# EAGLE design tuggerTrackerV1 (EAGLE 8.5.0)
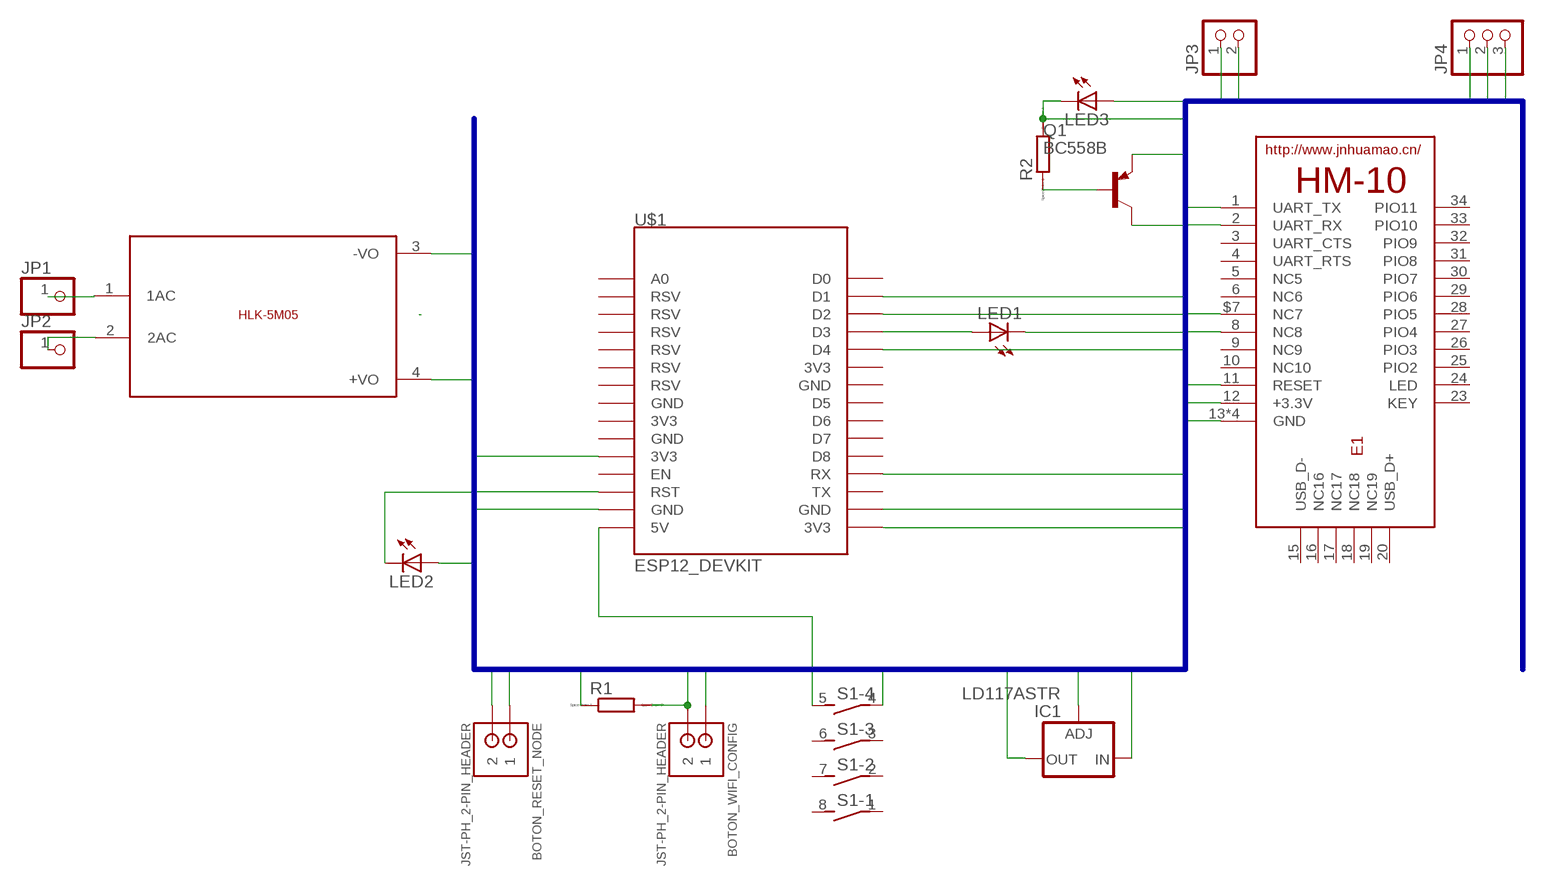
[diagram p0: schematic, sheet 1]

## Parts
BOTON_RESET_NODE  JST-PH_2-PIN_HEADER  [JST_B2B-PH_HEADER]
BOTON_WIFI_CONFIG  JST-PH_2-PIN_HEADER  [JST_B2B-PH_HEADER]
E1  HM-10-BOARD  [26.9X13X2.2_BOARD]
IC1  LD117ASTR  [SOT223]
JP1  PINHD-1X1  [1X01]
JP2  PINHD-1X1  [1X01]
JP3  PINHD-1X2  [1X02]
JP4  PINHD-1X3  [1X03]
LED1  LEDCHIPLED_1206  [CHIPLED_1206]
LED2  LEDCHIPLED_1206  [CHIPLED_1206]
LED3  LEDCHIPLED_1206  [CHIPLED_1206]
Q1  BC558B  [TO92-EBC]
R1  R0207/10  [0207/10]
R2  R0207/10  [0207/10]
S1  DIP04S  [DIP04S]
U$1  ESP12_DEVKIT  [ESP12_DEVKIT]
U$2  5VDC/5W  HLK-5M05  [HLK-5M05]

## Nets
BTPG1: E1.$7(NC7) JP4.1
BTPG2: E1.8(NC8) JP4.2
BTRST: E1.11(RESET) JP4.3
BTVCC: E1.12(+3.3V) Q1.C
D1: LED3.C R2.2 U$1.D1
D2: BOTON_WIFI_CONFIG.P2 R1.2 U$1.D2
GND: BOTON_RESET_NODE.P2 E1.13(GND) E1.14(GND) E1.21(GND) E1.22(GND) IC1.1(ADJ) JP3.1 LED1.C LED2.C R1.1 U$1.GND@1(GND) U$1.GND@3(GND) U$2.3(-VO)
N$1: S1.5 U$1.5V
N$2: Q1.B R2.1
N$3: JP1.1 U$2.1(1AC)
N$5: JP2.1 U$2.2(2AC)
N$6: LED1.A U$1.D3
NODRST: BOTON_RESET_NODE.P1 U$1.RST
NRXBTX: E1.1(UART_TX) U$1.RX
NTXBRX: E1.2(UART_RX) U$1.D4
V3NODE: BOTON_WIFI_CONFIG.P1 LED2.A LED3.A U$1.3V3@0(3V3) U$1.3V3@2(3V3)
V3REG: IC1.4(OUT) Q1.E
VIN: IC1.3(IN) JP3.2 S1.4 U$2.4(+VO)
Unconnected: E1.3(UART_CTS) E1.4(UART_RTS) E1.5(NC5) E1.6(NC6) E1.9(NC9) E1.10(NC10) E1.15(USB_D-) E1.16(NC16) E1.17(NC17) E1.18(NC18) E1.19(NC19) E1.20(USB_D+) E1.23(KEY) E1.24(LED) E1.25(PIO2) E1.26(PIO3) E1.27(PIO4) E1.28(PIO5) E1.29(PIO6) E1.30(PIO7) E1.31(PIO8) E1.32(PIO9) E1.33(PIO10) E1.34(PIO11) S1.1 S1.2 S1.3 S1.6 S1.7 S1.8 U$1.3V3@1(3V3) U$1.3V3@3(3V3) U$1.A0 U$1.D0 U$1.D5 U$1.D6 U$1.D7 U$1.D8 U$1.EN U$1.GND@0(GND) U$1.GND@2(GND) U$1.GND@4(GND) U$1.RSV@0(RSV) U$1.RSV@1(RSV) U$1.RSV@2(RSV) U$1.RSV@3(RSV) U$1.RSV@4(RSV) U$1.RSV@5(RSV) U$1.TX

## Buses
V3NODE,V3REG,VIN,GND,GNDBT,D1,D2,BTPG1,BTPG2,BTRST,BTVCC,NRXBTX,NTXBRX,NODRST

## Library data of the parts
BOTON_RESET_NODE BOTON_WIFI_CONFIG = SRG:JST-PH_2-PIN_HEADER: 2-pin JST PH Shrouded Header, top entry P/N B2B-PH-K-S Mating connector PHR-2 Mating cable assembly: Sparkfun PRT-09914 <http://www.sparkfun.com/products/9914>
E1 = JNHuaMao:HM-10: HM Bluetooth module use TI CC2540 or CC2541, Master and slave roles in one, transmission version and remote control version and PIO state acquisition functions in one, Support the AT command modify module parameters, Convenient and flexible.
IC1 = v-reg:LD117A?*: Low drop fixed and adjustable positive voltage regulators 1 A Source: http://www.st.com/stonline/products/literature/ds/7194/ld1117axx.pdf
JP1 JP2 = pinhead:PINHD-1X1: PIN HEADER
JP3 = pinhead:PINHD-1X2: PIN HEADER
JP4 = pinhead:PINHD-1X3: PIN HEADER
LED1-LED3 = led:LED: LED OSRAM: - CHIPLED LG R971, LG N971, LY N971, LG Q971, LY Q971, LO R971, LY R971 LH N974, LH R974 LS Q976, LO Q976, LY Q976 LO Q996 - Hyper CHIPLED LW Q18S LB Q993, LB Q99A, LB R99A - SideLED LS A670, LO A670, LY A670, LG A670, LP A670 LB A673, LV A673, LT A673, LW A673 LH A674 LY A675 LS A676, LA A676, LO A676, LY A676, LW A676 LS A679, LY A679, LG A679 - Hyper Micro SIDELED® LS Y876, LA Y876, LO Y876, LY Y876 LT Y87S - SmartLED LW L88C, LW L88S LB L89C, LB L89S, LG L890 LS L89K, LO L89K, LY L89K LS L896, LA L896, LO L896, LY L896 - TOPLED LS T670, LO T670, LY T670, LG T670, LP T670 LSG T670, LSP T670, LSY T670, LOP T670, LYG T670 LG T671, LOG T671, LSG T671 LB T673, LV T673, LT T673, LW T673 LH T674 LS T676, LA T676, LO T676, LY T676, LB T676, LH T676, LSB T676, LW T676 LB T67C, LV T67C, LT T67C, LS T67K, LO T67K, LY T67K, LW E67C LS E67B, LA E67B, LO E67B, LY E67B, LB E67C, LV E67C, LT E67C LW T67C LS T679, LY T679, LG T679 LS T770, LO T770, LY T770, LG T770, LP T770 LB T773, LV T773, LT T773, LW T773 LH T774 LS E675, LA E675, LY E675, LS T675 LS T776, LA T776, LO T776, LY T776, LB T776 LHGB T686 LT T68C, LB T68C - Hyper Mini TOPLED® LB M676 - Mini TOPLED Santana® LG M470 LS M47K, LO M47K, LY M47K Source: http://www.osram.convergy.de LUXEON: - LUMILED® LXK2-PW12-R00, LXK2-PW12-S00, LXK2-PW14-U00, LXK2-PW14-V00 LXK2-PM12-R00, LXK2-PM12-S00, LXK2-PM14-U00 LXK2-PE12-Q00, LXK2-PE12-R00, LXK2-PE12-S00, LXK2-PE14-T00, LXK2-PE14-U00 LXK2-PB12-K00, LXK2-PB12-L00, LXK2-PB12-M00, LXK2-PB14-N00, LXK2-PB14-P00, LXK2-PB14-Q00 LXK2-PR12-L00, LXK2-PR12-M00, LXK2-PR14-Q00, LXK2-PR14-R00 LXK2-PD12-Q00, LXK2-PD12-R00, LXK2-PD12-S00 LXK2-PH12-R00, LXK2-PH12-S00 LXK2-PL12-P00, LXK2-PL12-Q00, LXK2-PL12-R00 Source: www.luxeon.com KINGBRIGHT: KA-3528ASYC Source: www.kingbright.com
Q1 = transistor-pnp:BC558*: PNP Transistror
R1 R2 = eagle-ltspice:R: RESISTOR, European symbol; SPICEMODEL: NONE; SPICEPREFIX: R
S1 = switch-dil:DIP04S: DIL/CODE SWITCH; OC_FARNELL: unknown; OC_NEWARK: unknown
U$1 = ESP12_DEVKIT:ESP12_DEVKIT: ESP12 DEVKIT BOARD
U$2 = HLK-5M05:HLK-5M05: HLK-5M05 is an 5Volt/5W smps developed by HI-LINK; SIZE: 23x38(mm)

## Board
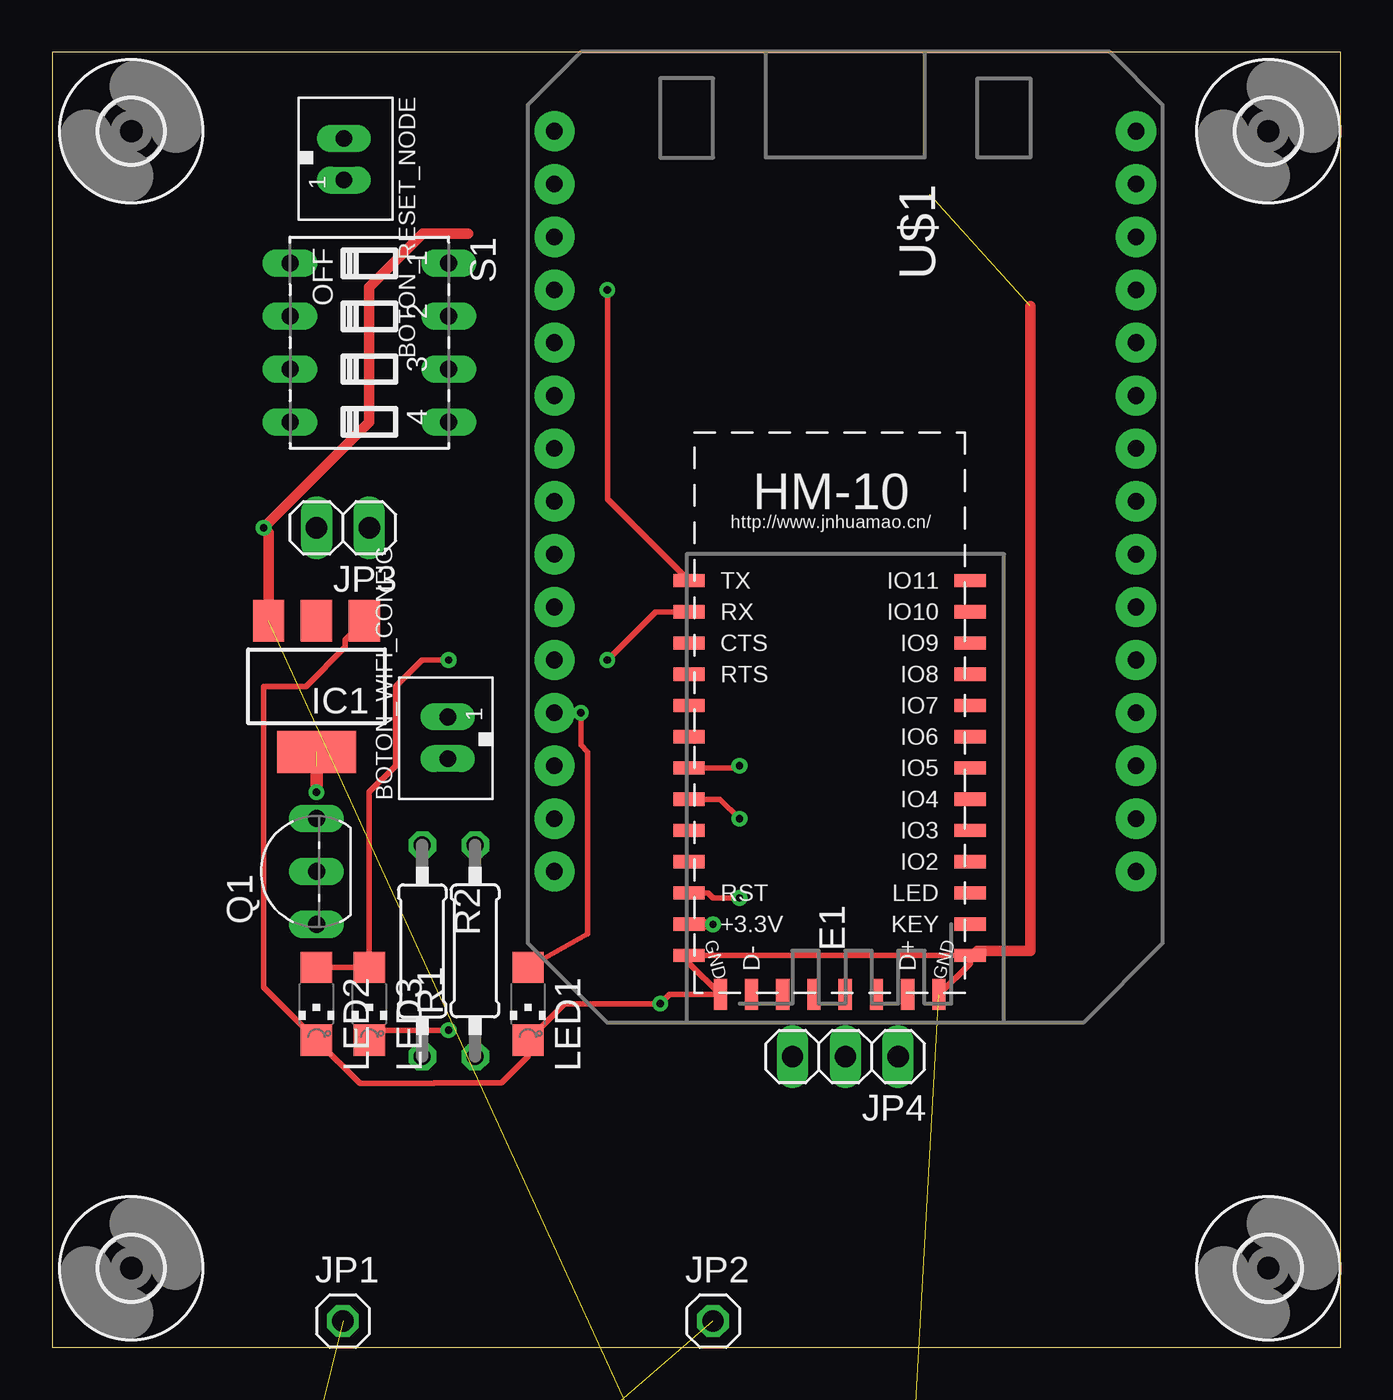
[diagram p1: board, top side]
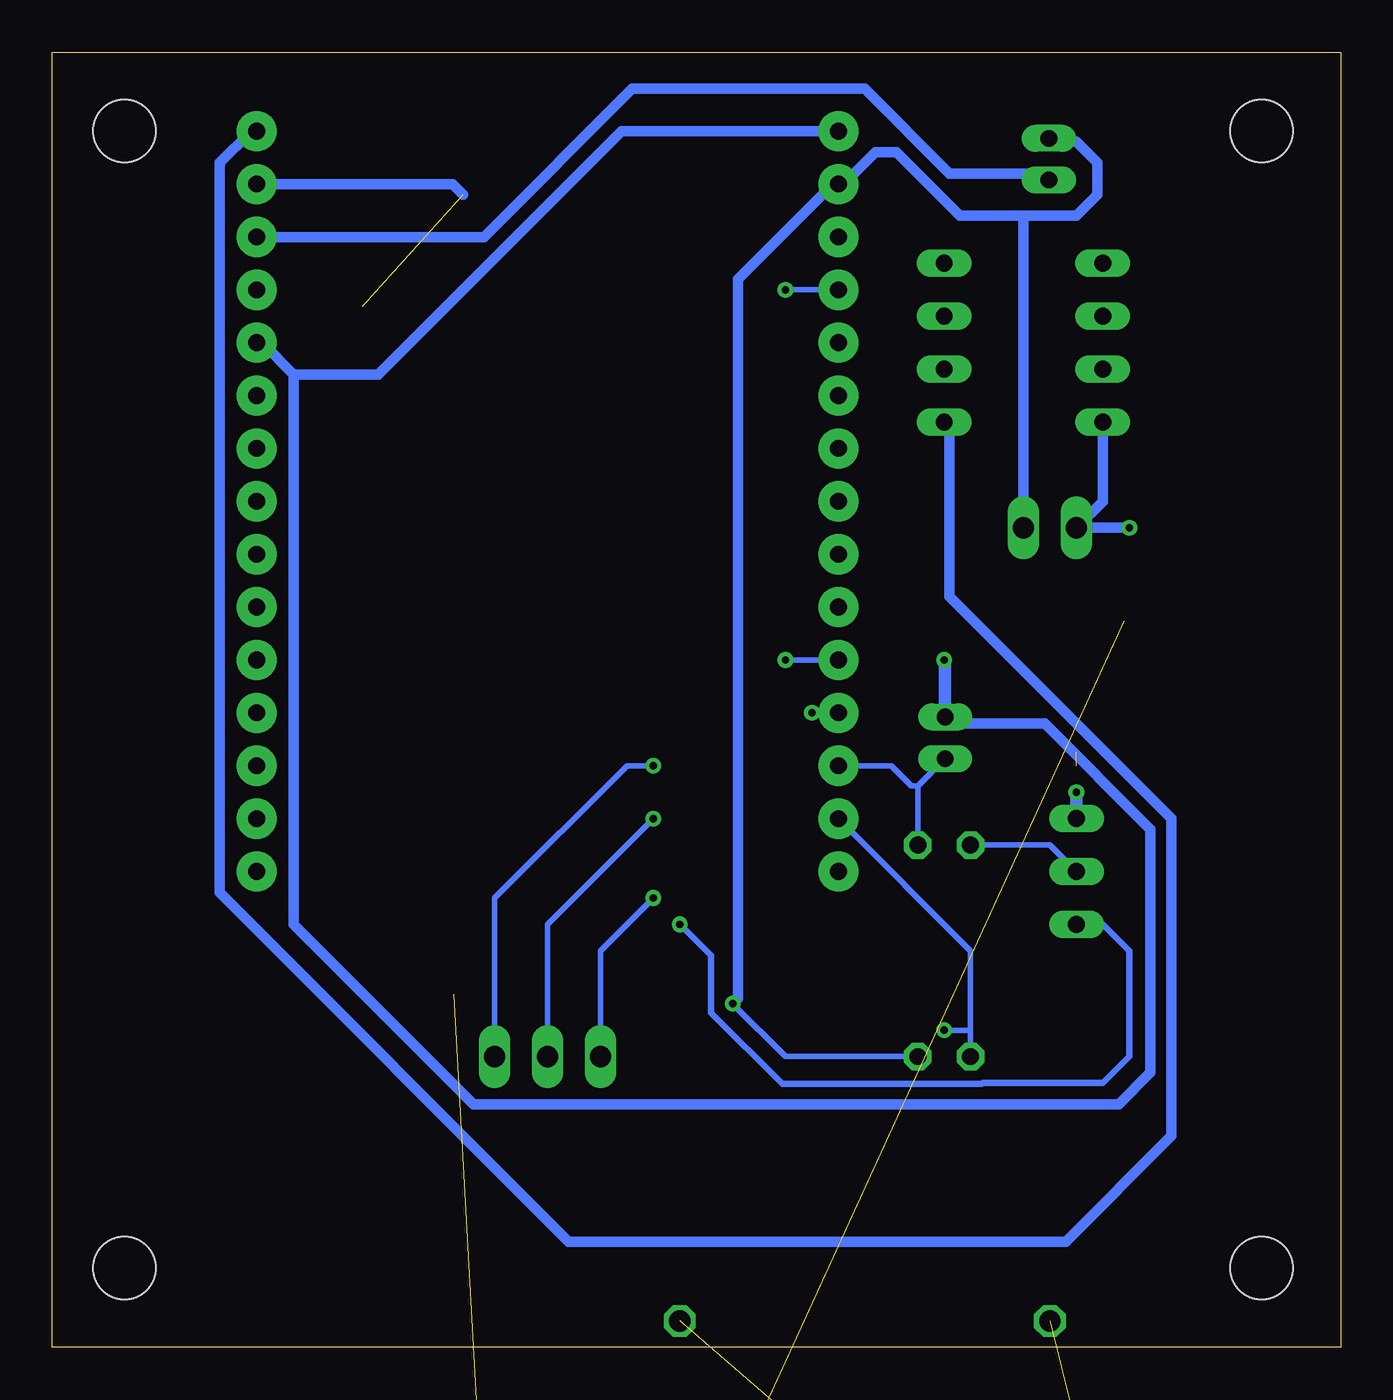
[diagram p2: board, bottom side, seen from below]

Size 61.9 x 62.22 mm. Coordinates in mm from the lower left corner, seen from the top.
Outline: 0,0 61.9,0 61.9,62.22 0,62.22 0,0
Copper layers (1*16): Top 0.035mm / dielectric 1.5mm / Bottom 0.035mm
Design rules "default *": minimum track width 20mil, minimum drill 0.35mm, track to track 20mil, track to pad 20mil, pad to pad 20mil, via to via 20mil, smd to smd 20mil, copper to edge 40mil, drill to drill 20mil, minimum pad ring 10mil, minimum via ring 8mil, stop-mask expansion 4mil, vias tented up to drill 0mil, thermal gap 10mil

### Footprints (pad centres in the part's own frame; a part is rotated, then mirrored left to right if it is on the bottom)
JST_B2B-PH_HEADER = drill 0.8 long: P1 1.075,0.048; P2 -0.925,0.048
26.9X13X2.2_BOARD = smd 1.5 x 0.635: 1 -7.5,0; 2 -7.5,-1.5; 3 -7.5,-3; 4 -7.5,-4.5; 5 -7.5,-6; 6 -7.5,-7.5; 8 -7.5,-10.5; 9 -7.5,-12; 10 -7.5,-13.5; 11 -7.5,-15; 12 -7.5,-16.5; 13 -7.5,-18; 22 6,-18; 23 6,-16.5; 24 6,-15; 25 6,-13.5; 26 6,-12; 27 6,-10.5; 28 6,-9; 29 6,-7.5; 30 6,-6; 31 6,-4.5; 32 6,-3; 33 6,-1.5; 34 6,0; $7 -7.5,-9 | smd 0.635 x 1.5: 14 -6,-19.875; 15 -4.5,-19.875; 16 -3,-19.875; 17 -1.5,-19.875; 18 0,-19.875; 19 1.5,-19.875; 20 3,-19.875; 21 4.5,-19.875
SOT223 = smd 1.5 x 2: 1 -2.3,-3.15; 2 0,-3.15; 3 2.3,-3.15 | smd 3.8 x 2: 4 0,3.15
1X01 = drill 1.016 octagon: 1 0,0
1X02 = drill 1.016 long: 1 -1.27,0; 2 1.27,0
1X03 = drill 1.016 long: 1 -2.54,0; 2 0,0; 3 2.54,0
CHIPLED_1206 = smd 1.5 x 1.5: A 0,-1.75; C 0,1.75
TO92-EBC = drill 0.813 long: B 0,-1.27; C -2.54,-1.27; E 2.54,-1.27
0207/10 = drill 0.813 octagon: 1 -5.08,0; 2 5.08,0
DIP04S = drill 0.813 long: 1 -3.81,-3.81; 2 -1.27,-3.81; 3 1.27,-3.81; 4 3.81,-3.81; 5 3.81,3.81; 6 1.27,3.81; 7 -1.27,3.81; 8 -3.81,3.81
ESP12_DEVKIT = drill 0.8 pad 1.93: 3V3@0 -13.97,-7.62; 3V3@1 13.97,5.08; 3V3@2 13.97,-17.78; 3V3@3 -13.97,-2.54; 5V -13.97,-17.78; A0 -13.97,17.78; D0 13.97,17.78; D1 13.97,15.24; D2 13.97,12.7; D3 13.97,10.16; D4 13.97,7.62; D5 13.97,0; D6 13.97,-2.54; D7 13.97,-5.08; D8 13.97,-7.62; EN -13.97,-10.16; GND@0 -13.97,-5.08; GND@1 -13.97,-15.24; GND@2 13.97,2.54; GND@3 13.97,-15.24; GND@4 -13.97,0; RST -13.97,-12.7; RSV@0 -13.97,15.24; RSV@1 -13.97,12.7; RSV@2 -13.97,10.16; RSV@3 -13.97,7.62; RSV@4 -13.97,5.08; RSV@5 -13.97,2.54; RX 13.97,-10.16; TX 13.97,-12.7
HLK-5M05 = drill 0.8 square: 1 -16.85,-2.93; 2 -16.85,2.97; 3 16.75,9.07; 4 16.75,-8.93
3,0 = hole 3: 0,0

### Placement (x,y rotation side)
BOTON_RESET_NODE  13.97,57.15 270 top
BOTON_WIFI_CONFIG  19.05,29.21 90 top
E1  38.1,36.83 0 top
IC1  12.7,31.75 180 top
JP1  13.97,1.27 0 top
JP2  31.75,1.27 0 top
JP3  13.97,39.37 180 top
JP4  38.1,13.97 180 top
LED1  22.86,16.51 180 top
LED2  12.7,16.51 180 top
LED3  15.24,16.51 180 top
Q1  11.43,22.86 90 top
R1  20.32,19.05 90 top
R2  17.78,19.05 270 top
S1  15.24,48.26 270 top
U$1  38.1,40.64 180 top
U$2  24.13,-22.86 0 top  (outside the outline)
U$6  [3,0]  3.81,58.42 0 top
U$7  [3,0]  58.42,58.42 0 top
U$8  [3,0]  3.81,3.81 0 top
U$9  [3,0]  58.42,3.81 0 top

### Tracks (layer width: path | path; a pad name or v marks a point on that pad's centre or on a via)
BTPG1  (via drill 0.35)
  Top 0.254: E1.$7 32.91,27.83 v33.02,27.94
  Bottom 0.254: JP4.1 40.64,21.59 34.29,27.94 v33.02,27.94
BTPG2  (via drill 0.35)
  Top 0.254: E1.8 32.09,26.33 v33.02,25.4
  Bottom 0.254: v33.02,25.4 38.1,20.32 JP4.2
BTRST  (via drill 0.35)
  Top 0.254: E1.11 31.51,21.83 31.75,21.59 v33.02,21.59
  Bottom 0.254: JP4.3 35.56,19.05 v33.02,21.59
BTVCC  (via drill 0.35)
  Top 0.508: v31.75,20.32 v31.74,20.33 E1.12
  Bottom 0.305: v31.75,20.32 30.25,18.82 30.25,16.08 26.82,12.65 17.23,12.65 17.18,12.7 11.43,12.7 10.16,13.97 10.16,19.05 11.43,20.32 Q1.C
D1  (via drill 0.35)
  Top 0.254: LED3.C 15.72,15.24 v19.05,15.24
  Bottom 0.254: U$1.D1 17.78,19.05 17.78,15.24 | 17.78,15.24 R2.2 | v19.05,15.24 17.78,15.24
D2
  Bottom 0.254: 20.32,26.97 BOTON_WIFI_CONFIG.P2 | R1.2 20.32,26.97 | 20.32,26.97 20.62,26.97 21.59,27.94 U$1.D2
GND  (via drill 0.35)  (2 unrouted)
  Top 0.254: E1.21 44.1,18.45 E1.22 E1.13 30.6,18.45 E1.14 29.66,16.95 v29.21,16.51 24.61,16.51 LED1.C 22.86,13.97 21.59,12.7 18.34,12.7 18.32,12.68 14.79,12.68 LED2.C 10.16,17.3 10.16,31.75 12.2,31.75 14.09,33.64 14.09,33.98 IC1.1
  Top 0.508: 46.99,50.01 46.99,19.05 44.45,19.05 44.23,18.83 E1.22
  Bottom 0.254: v29.21,16.51 26.67,13.97 R1.1
  Bottom 0.508: U$1.GND@1 42.67,55.88 42.16,55.37 | 15.24,54.36 18.29,54.36 21.34,57.4 22.35,57.4 23.88,55.88 U$1.GND@3 24.38,55.88 28.96,51.31 28.96,16.76 v29.21,16.51 | 15.24,54.36 12.7,54.36 11.68,55.37 11.68,56.9 12.7,57.91 13.72,57.91 BOTON_RESET_NODE.P2 | 15.24,54.36 JP3.1
N$1
  Bottom 0.508: S1.5 18.8,44.2 18.8,36.07 8.13,25.4 8.13,10.16 13.21,5.08 37.08,5.08 53.85,21.84 53.85,56.9 52.32,58.42 U$1.5V
N$2
  Bottom 0.254: R2.1 13.97,24.13 Q1.B
N$3  (1 unrouted)
N$5  (1 unrouted)
N$6  (via drill 0.35)
  Top 0.254: v25.4,30.48 25.4,28.93 25.73,28.6 25.73,19.86 LED1.A
  Bottom 0.254: U$1.D3 v25.4,30.48
NODRST
  Bottom 0.508: U$1.RST 41.15,53.34 34.04,60.45 22.86,60.45 18.8,56.39 14.22,56.39 BOTON_RESET_NODE.P1
NRXBTX  (via drill 0.35)
  Top 0.254: E1.1 26.67,40.76 v26.67,50.8
  Bottom 0.254: U$1.RX v26.67,50.8
NTXBRX  (via drill 0.35)
  Top 0.254: v26.67,33.02 28.98,35.33 E1.2
  Bottom 0.254: U$1.D4 v26.67,33.02
V3NODE  (via drill 0.35)
  Top 0.254: LED2.A LED3.A 15.24,26.67 16.51,27.94 16.51,31.75 17.78,33.02 v19.05,33.02
  Bottom 0.508: 50.29,46.74 50.29,20.32 41.66,11.68 10.67,11.68 9.14,13.21 9.14,24.89 14.22,29.97 18.8,29.97 BOTON_WIFI_CONFIG.P1 | 50.29,46.74 51.82,48.26 U$1.3V3@0 | U$1.3V3@2 34.54,58.42 46.23,46.74 50.29,46.74
  Bottom 0.61: v19.05,33.02 19,32.97 BOTON_WIFI_CONFIG.P1
V3REG  (via drill 0.35)  (1 unrouted)
  Top 0.61: v12.7,26.67 12.7,27.94
  Bottom 0.61: Q1.E v12.7,26.67
VIN  (via drill 0.35)  (1 unrouted)
  Top 0.508: IC1.3 10.4,39.13 v10.16,39.37 15.24,44.45 15.24,50.93 17.8,53.49 19.99,53.49
  Bottom 0.508: v10.16,39.37 JP3.2 11.43,40.64 S1.4